# Altium schematic sheet mcu.SchDoc
size A4
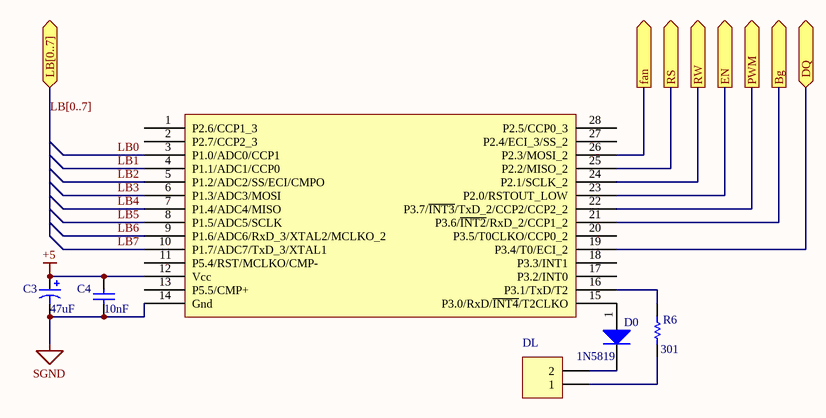
[diagram p0: mcu.SchDoc]

## Parts
C3  value 47uF  [25V47uF(DIP)]  (hidden comment: Cap1)
C4  value 10nF  [0805(M)]  (hidden comment: Cap2)
D0  1N5819  [SMA(M)]
DL  2Pin  [2Pin(DIP)]  (value not drawn)
R6  value 301  [0805(M)]  (hidden comment: Res)
U0  STC15W401AS_SOP28_TSSOP28_SKDIP28  [SOP28]  (value not drawn)

## Ports
Bg (out), DQ (bidir), EN (out), fan (out), LB[0..7] (bidir), PWM (out), RS (out), RW (out)

## Nets
+5: C3.1 C4.2 U0.12(Vcc)
SGND: C3.2 C4.1 U0.14(Gnd)
Bg: U0.21(P3.6/~{INT2}/RxD_2/CCP1_2) ; port Bg
DQ: U0.19(P3.4/T0/ECI_2) ; port DQ
EN: U0.23(P2.0/RSTOUT_LOW) ; port EN
fan: U0.26(P2.3/MOSI_2) ; port fan
LB0: U0.3(P1.0/ADC0/CCP1)
LB1: U0.4(P1.1/ADC1/CCP0)
LB2: U0.5(P1.2/ADC2/SS/ECI/CMPO)
LB3: U0.6(P1.3/ADC3/MOSI)
LB4: U0.7(P1.4/ADC4/MISO)
LB5: U0.8(P1.5/ADC5/SCLK)
LB6: U0.9(P1.6/ADC6/RxD_3/XTAL2/MCLKO_2)
LB7: U0.10(P1.7/ADC7/TxD_3/XTAL1)
PWM: U0.22(P3.7/~{INT3}/TxD_2/CCP2/CCP2_2) ; port PWM
RS: U0.25(P2.2/MISO_2) ; port RS
RW: U0.24(P2.1/SCLK_2) ; port RW
NetD0_1: D0.1(P) U0.15(P3.0/RxD/~{INT4}/T2CLKO)
NetD0_2: D0.2(N) DL.2
NetDL_1: DL.1 R6.2
NetR6_1: R6.1 U0.16(P3.1/TxD/T2)

Not connected (* = marked no-connect by the designer): U0 1(P2.6/CCP1_3) 2(P2.7/CCP2_3) 11(P5.4/RST/MCLKO/CMP-) 13(P5.5/CMP+) 17(P3.2/INT0) 18(P3.3/INT1) 20(P3.5/T0CLKO/CCP0_2) 27(P2.4/ECI_3/SS_2) 28(P2.5/CCP0_3)

## Buses and harness runs
bus LB[0..7] = port LB[0..7]

## Library data of the parts
C3 = Cap1: 极性电容
C4 = Cap2: 非极性电容
D0 = Diode2: 肖特基二极管